# EAGLE design buffer (EAGLE 4.14)
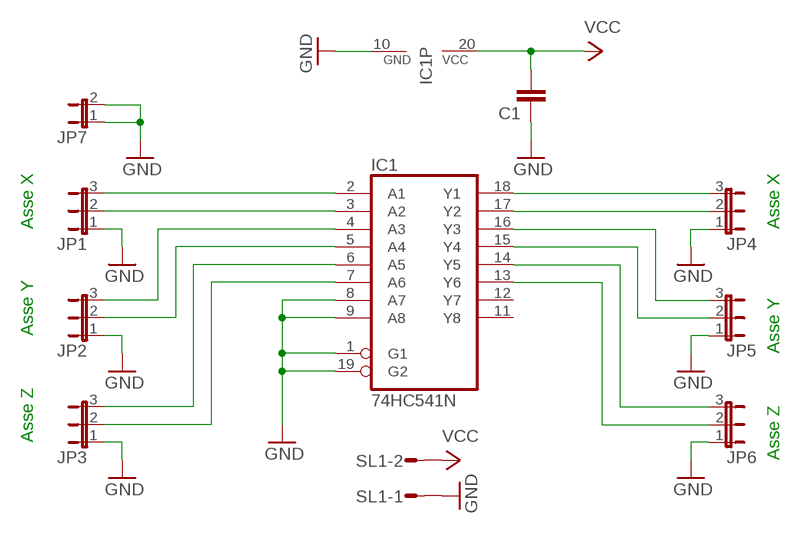
[diagram p0: schematic, sheet 1]

## Parts
C1  C5/5  [C5B5]
IC1  74HC541N  [DIL20]
JP1  JP2E  [JP2]
JP2  JP2E  [JP2]
JP3  JP2E  [JP2]
JP4  JP2E  [JP2]
JP5  JP2E  [JP2]
JP6  JP2E  [JP2]
JP7  JP1E  [JP1]
SL1  MA02S  [02PA]

## Nets
GND: C1.1 IC1.1(G1) IC1.8(A7) IC1.9(A8) IC1.10(GND) IC1.19(G2) JP1.1 JP2.1 JP3.1 JP4.1 JP5.1 JP6.1 JP7.1 JP7.2 SL1.1
N$1: IC1.2(A1) JP1.3
N$2: IC1.3(A2) JP1.2
N$3: IC1.4(A3) JP2.3
N$4: IC1.5(A4) JP2.2
N$5: IC1.6(A5) JP3.3
N$6: IC1.7(A6) JP3.2
N$7: IC1.18(Y1) JP4.3
N$8: IC1.17(Y2) JP4.2
N$9: IC1.16(Y3) JP5.3
N$10: IC1.15(Y4) JP5.2
N$11: IC1.14(Y5) JP6.3
N$12: IC1.13(Y6) JP6.2
VCC: C1.2 IC1.20(VCC) SL1.2
Unconnected: IC1.11(Y8) IC1.12(Y7)

## Notes on the sheet
- Asse X | Asse X
- Asse Y
- Asse Y
- Asse Z
- Asse Z

## Library data of the parts
C1 = capacitor-wima:C: CAPACITOR naming: grid - package width
IC1 = 74xx-eu:74*541: Octal BUFFER and LINE DRIVER, 3-state
JP1-JP6 = jumper:JP2E: JUMPER
JP7 = jumper:JP1E: JUMPER
SL1 = con-amp-quick:MA02S: AMP QUICK CONNECTOR

## Board
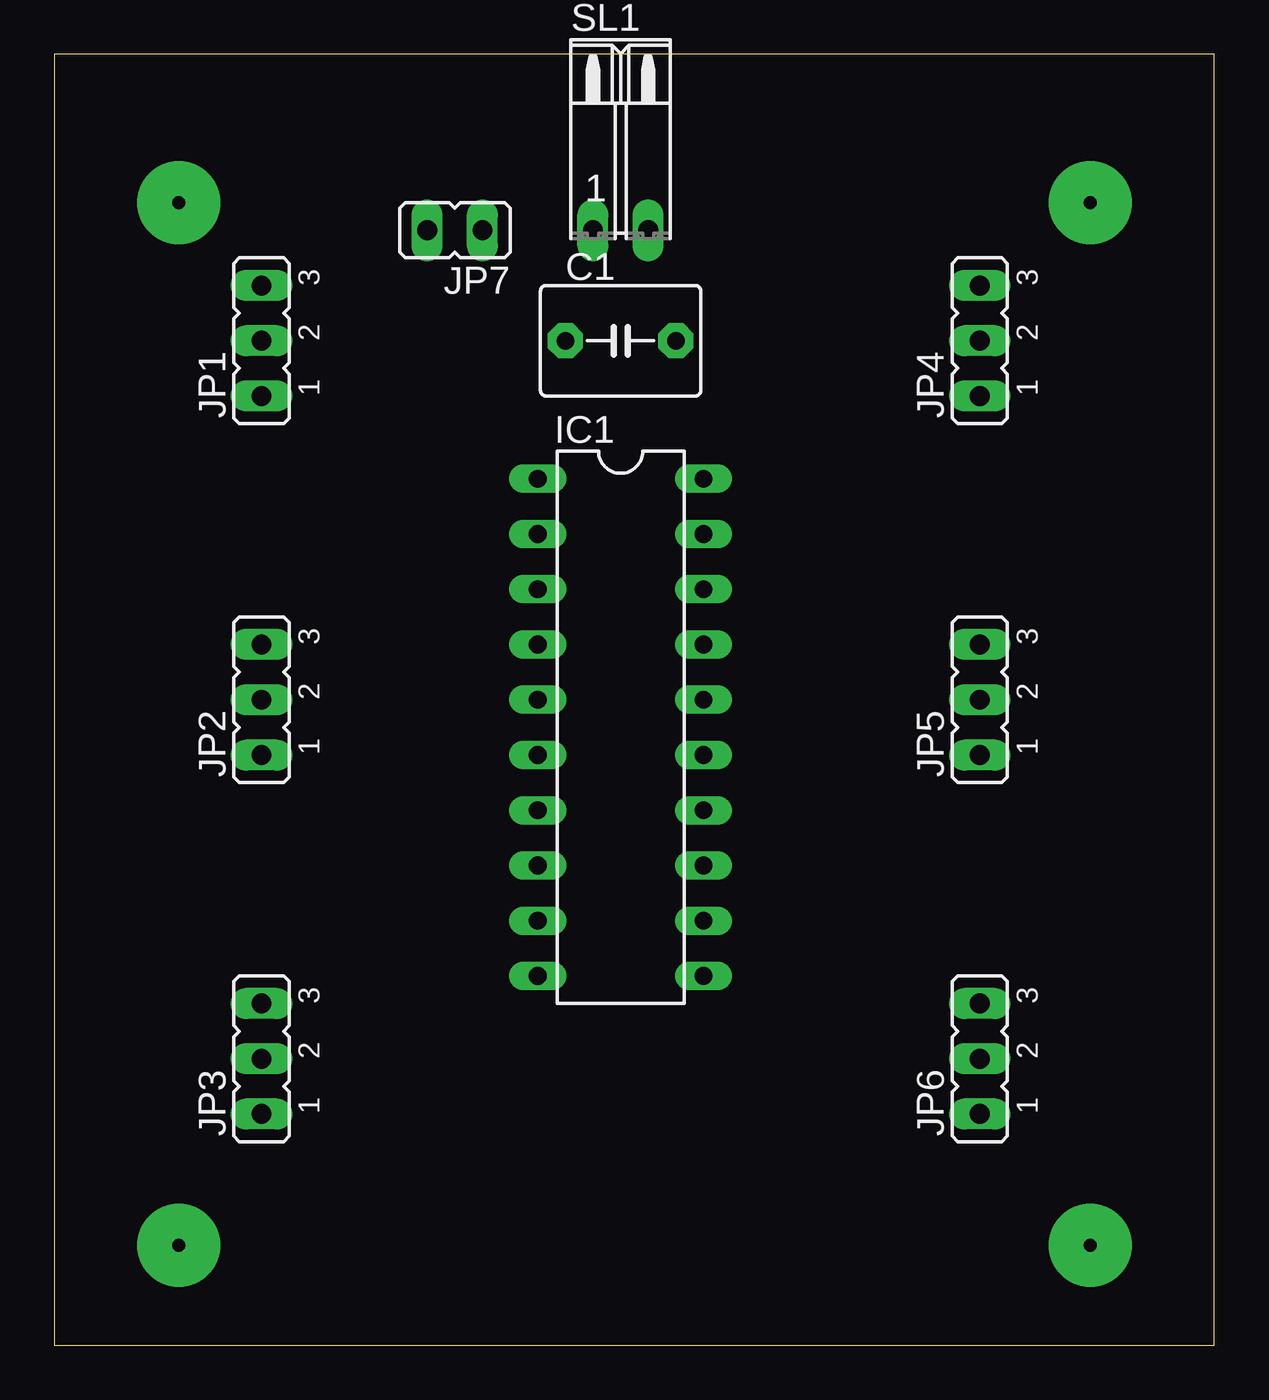
[diagram p1: board, top side]
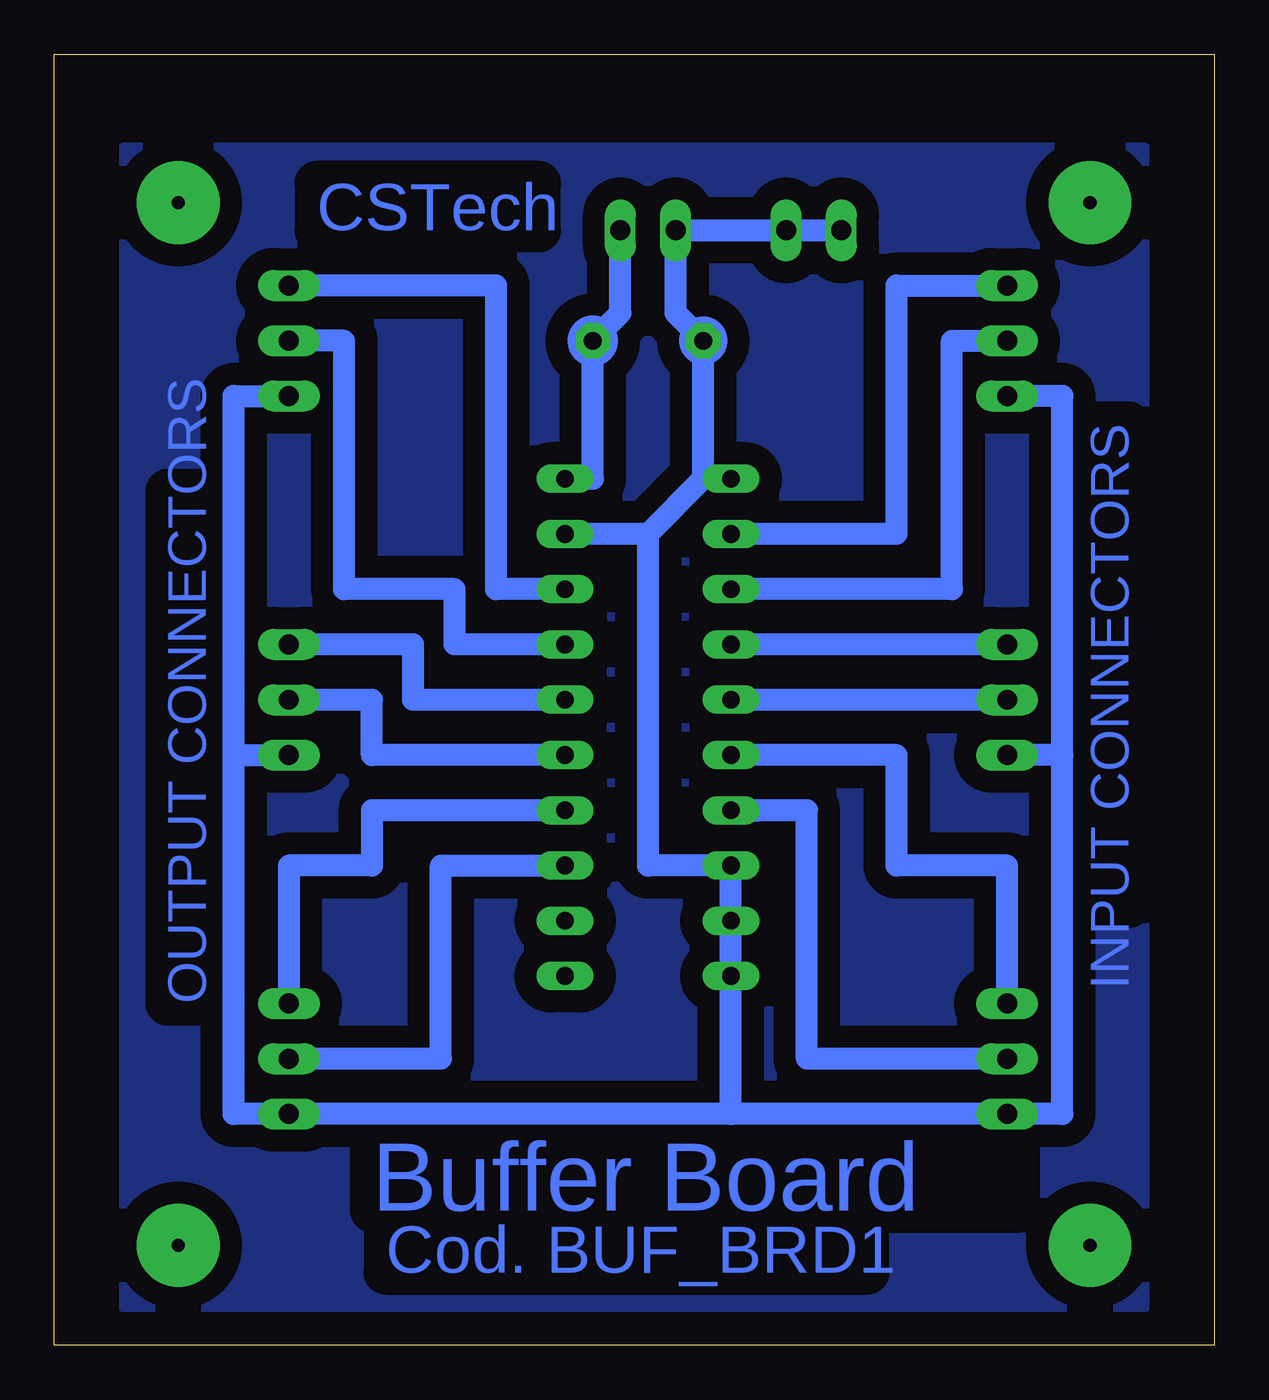
[diagram p2: board, bottom side, seen from below]

Size 53.32 x 59.36 mm. Coordinates in mm from the lower left corner, seen from the top.
Outline: 0,0 53.32,0 53.32,59.36 0,59.36 0,0
Copper layers (1*16): Top 0.035mm / dielectric 1.5mm / Bottom 0.035mm
Design rules "default": minimum track width 40mil, minimum drill 24mil, track to track 8mil, track to pad 8mil, pad to pad 8mil, via to via 8mil, smd to smd 8mil, copper to edge 40mil, drill to drill 8mil, minimum pad ring 10mil, minimum via ring 8mil, stop-mask expansion 4mil, vias tented up to drill 0mil, thermal gap 10mil

### Footprints (pad centres in the part's own frame; a part is rotated, then mirrored left to right if it is on the bottom)
C5B5 = drill 0.813 pad 1.6 octagon: 1 -2.54,0; 2 2.54,0
DIL20 = drill 0.813 long: 1 -11.43,-3.81; 2 -8.89,-3.81; 3 -6.35,-3.81; 4 -3.81,-3.81; 5 -1.27,-3.81; 6 1.27,-3.81; 7 3.81,-3.81; 8 6.35,-3.81; 9 8.89,-3.81; 10 11.43,-3.81; 11 11.43,3.81; 12 8.89,3.81; 13 6.35,3.81; 14 3.81,3.81; 15 1.27,3.81; 16 -1.27,3.81; 17 -3.81,3.81; 18 -6.35,3.81; 19 -8.89,3.81; 20 -11.43,3.81
JP2 = drill 0.914 long: 1 -2.54,0; 2 0,0; 3 2.54,0
JP1 = drill 0.914 long: 1 0,-1.27; 2 0,1.27
02PA = drill 0.914 long: 1 -1.27,0; 2 1.27,0

### Placement (x,y rotation side)
C1  26.03,46.19 0 top
IC1  26.03,28.41 270 top
JP1  9.52,46.19 90 top
JP2  9.52,29.68 90 top
JP3  9.52,13.17 90 top
JP4  42.54,46.19 90 top
JP5  42.54,29.68 90 top
JP6  42.54,13.17 90 top
JP7  18.41,51.27 90 top
SL1  26.03,51.27 0 top

### Tracks (layer width: path | path; a pad name or v marks a point on that pad's centre or on a via)
GND
  Bottom 1.016: 45.08,27.14 45.08,43.65 JP4.1 | 6.98,27.14 6.98,43.65 JP1.1 | 22.22,10.63 JP3.1 6.98,10.63 6.98,27.14 | 22.22,10.63 IC1.10 IC1.9 IC1.8 26.03,22.06 26.03,37.3 | 22.22,10.63 JP6.1 45.08,10.63 45.08,27.14 | 6.98,27.14 JP2.1 | 45.08,27.14 JP5.1 | 26.03,37.3 23.49,39.84 | 26.03,37.3 IC1.19 | 23.49,39.84 C1.1 24.76,47.46 SL1.1 JP7.1 JP7.2 | 23.49,39.84 IC1.1
N$1
  Bottom 1.016: IC1.2 14.6,37.3 14.6,48.73 JP1.3
N$2
  Bottom 1.016: IC1.3 12.06,34.76 12.06,46.19 JP1.2
N$3
  Bottom 1.016: JP2.3 IC1.4
N$4
  Bottom 1.016: JP2.2 IC1.5
N$5
  Bottom 1.016: IC1.6 14.6,27.14 14.6,22.06 9.52,22.06 JP3.3
N$6
  Bottom 1.016: 21.27,24.6 IC1.7 | 21.27,24.6 20.95,24.6 | JP3.2 18.73,13.17 18.73,24.6 21.27,24.6
N$7
  Bottom 1.016: IC1.18 33.02,34.76 33.02,48.73 JP4.3
N$8
  Bottom 1.016: JP4.2 40,46.19 40,34.76 34.92,34.76 34.92,32.22 IC1.17
N$9
  Bottom 1.016: IC1.16 36.83,29.68 36.83,32.22 JP5.3
N$10
  Bottom 1.016: IC1.15 38.73,27.14 38.73,29.68 JP5.2
N$11
  Bottom 1.016: JP6.3 42.54,22.06 38.73,22.06 38.73,24.6 IC1.14
N$12
  Bottom 1.016: JP6.2 35.56,13.17 35.56,22.06 IC1.13
N$13  (via drill 0.6 pad 3.81)
  other vias: 5.71,4.6
N$14  (via drill 0.6 pad 3.81)
  other vias: 47.62,4.6
N$15  (via drill 0.6 pad 3.81)
  other vias: 47.62,52.54
N$16  (via drill 0.6 pad 3.81)
  other vias: 5.71,52.54
N$17
  pour Bottom (isolate 1.016): 3.17,55.08 50.16,55.08 50.16,1.74 3.17,1.74
VCC
  Bottom 1.016: IC1.20 28.57,39.84 C1.2 27.3,47.46 SL1.2
(copper drawn outside any net)
  shapes: Bottom circle x2

### Text on the board
Bottom: CSTech | INPUT CONNECTORS | OUTPUT CONNECTORS | Buffer Board | Cod. BUF_BRD1